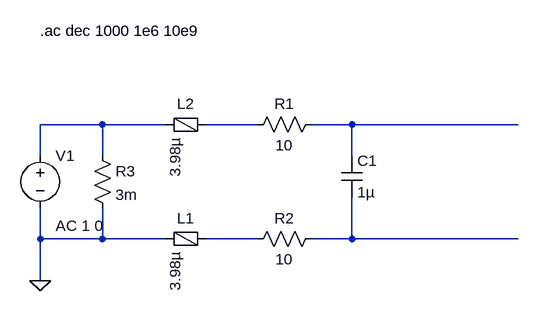
[diagram p0: schematic current_sense.asc]
current_sense.asc, the LTspice schematic file:
Version 4
SHEET 1 880 680
WIRE 112 80 16 80
WIRE 208 80 112 80
WIRE 352 80 272 80
WIRE 496 80 432 80
WIRE 752 80 496 80
WIRE 16 128 16 80
WIRE 112 128 112 80
WIRE 496 128 496 80
WIRE 16 256 16 208
WIRE 112 256 112 208
WIRE 112 256 16 256
WIRE 208 256 112 256
WIRE 352 256 272 256
WIRE 496 256 496 192
WIRE 496 256 432 256
WIRE 752 256 496 256
WIRE 16 320 16 256
FLAG 16 320 0
SYMBOL voltage 16 112 R0
WINDOW 123 24 124 Left 2
WINDOW 39 0 0 Left 0
SYMATTR InstName V1
SYMATTR Value ""
SYMATTR Value2 AC 1 0
SYMBOL FerriteBead 240 256 R90
WINDOW 0 -16 0 VBottom 2
SYMATTR InstName L1
SYMATTR Value 3.98µ
SYMATTR SpiceLine Rser=2 Rpar=2800 Cpar=25f
SYMBOL FerriteBead 240 80 R90
WINDOW 0 -16 0 VBottom 2
SYMATTR InstName L2
SYMATTR Value 3.98µ
SYMATTR SpiceLine Rser=2 Rpar=2800 Cpar=25f
SYMBOL res 448 64 R90
WINDOW 0 0 56 VBottom 2
WINDOW 3 32 56 VTop 2
SYMATTR InstName R1
SYMATTR Value 10
SYMBOL res 448 240 R90
WINDOW 0 0 56 VBottom 2
WINDOW 3 32 56 VTop 2
SYMATTR InstName R2
SYMATTR Value 10
SYMBOL res 96 112 R0
SYMATTR InstName R3
SYMATTR Value 3m
SYMBOL cap 480 128 R0
SYMATTR InstName C1
SYMATTR Value 1µ
TEXT 16 -64 Left 2 !.ac dec 1000 1e6 10e9

The netlist it stands for:
* current_sense.asc
V1 N001 0 AC 1 0
L1 N004 0 3.98µ Rser=2 Rpar=2800 Cpar=25f
L2 N002 N001 3.98µ Rser=2 Rpar=2800 Cpar=25f
R1 N003 N002 10
R2 N005 N004 10
R3 N001 0 3m
C1 N003 N005 1µ
.ac dec 1000 1e6 10e9
.backanno
.end